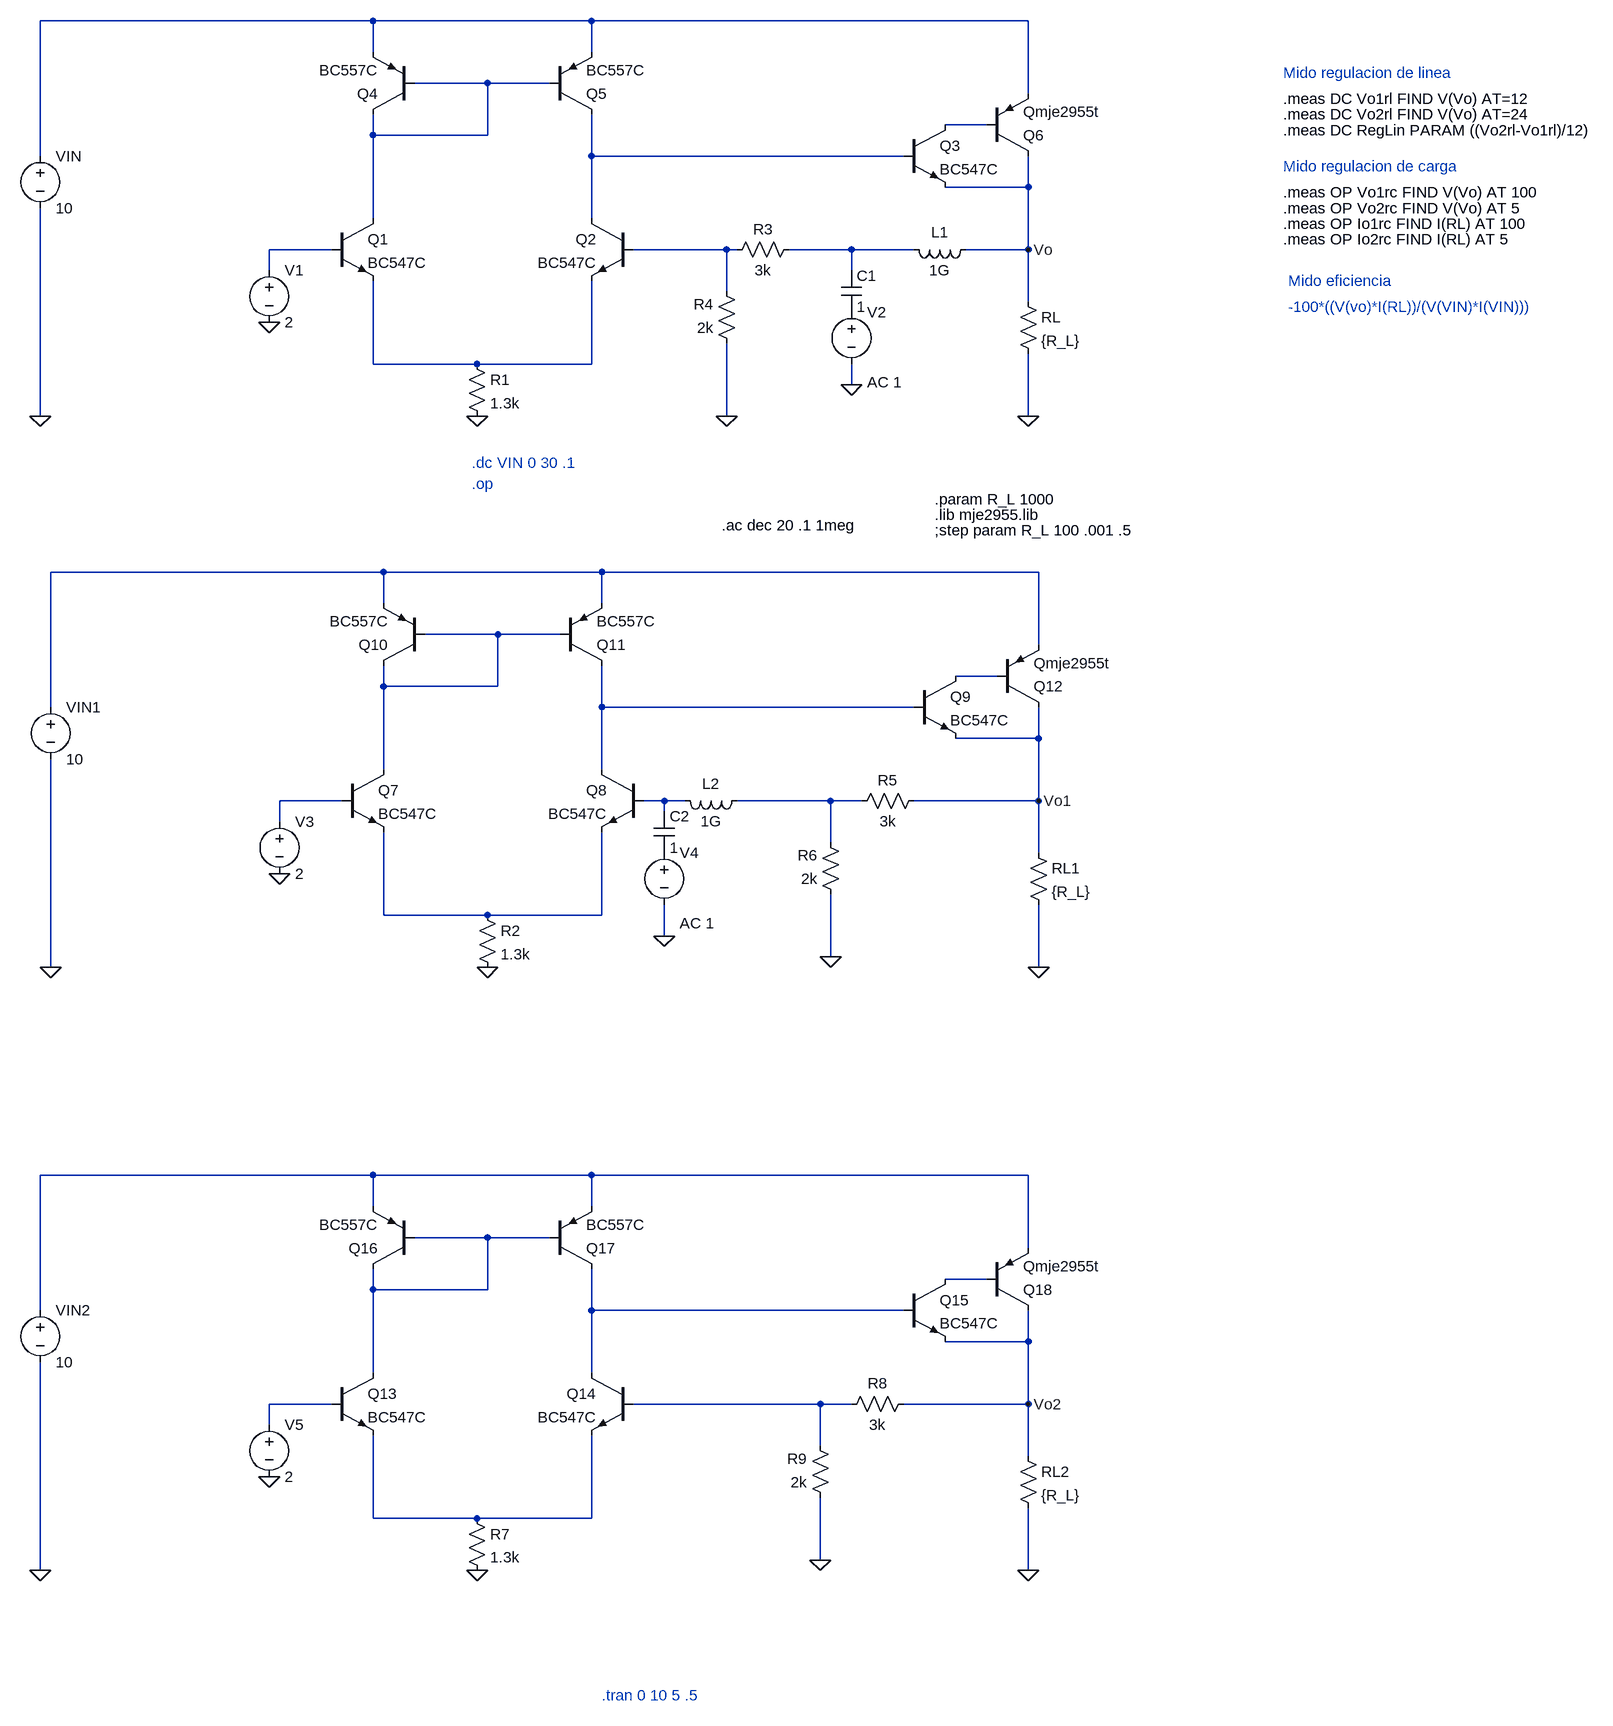
[diagram p0: schematic primer_check_2.asc]
primer_check_2.asc, the LTspice schematic file:
Version 4.1
SHEET 1 2012 2384
WIRE 96 -208 -416 -208
WIRE 432 -208 96 -208
WIRE 1104 -208 432 -208
WIRE 96 -160 96 -208
WIRE 432 -160 432 -208
WIRE 272 -112 160 -112
WIRE 368 -112 272 -112
WIRE 1104 -96 1104 -208
WIRE 1040 -48 976 -48
WIRE 96 -32 96 -64
WIRE 272 -32 272 -112
WIRE 272 -32 96 -32
WIRE -416 0 -416 -208
WIRE 432 0 432 -64
WIRE 912 0 432 0
WIRE 1104 48 1104 0
WIRE 1104 48 976 48
WIRE 96 96 96 -32
WIRE 432 96 432 0
WIRE 32 144 -64 144
WIRE 640 144 496 144
WIRE 656 144 640 144
WIRE 832 144 736 144
WIRE 928 144 832 144
WIRE 1104 144 1104 48
WIRE 1104 144 1008 144
WIRE -64 176 -64 144
WIRE 832 176 832 144
WIRE 640 208 640 144
WIRE 1104 224 1104 144
WIRE 96 320 96 192
WIRE 256 320 96 320
WIRE 432 320 432 192
WIRE 432 320 256 320
WIRE 832 352 832 320
WIRE -416 400 -416 80
WIRE 640 400 640 288
WIRE 1104 400 1104 304
WIRE 112 640 -400 640
WIRE 448 640 112 640
WIRE 1120 640 448 640
WIRE 112 688 112 640
WIRE 448 688 448 640
WIRE 288 736 176 736
WIRE 384 736 288 736
WIRE 1120 752 1120 640
WIRE 1056 800 992 800
WIRE 112 816 112 784
WIRE 288 816 288 736
WIRE 288 816 112 816
WIRE -400 848 -400 640
WIRE 448 848 448 784
WIRE 928 848 448 848
WIRE 1120 896 1120 848
WIRE 1120 896 992 896
WIRE 112 944 112 816
WIRE 448 944 448 848
WIRE 48 992 -48 992
WIRE 544 992 512 992
WIRE 576 992 544 992
WIRE 800 992 656 992
WIRE 848 992 800 992
WIRE 1120 992 1120 896
WIRE 1120 992 928 992
WIRE 544 1008 544 992
WIRE -48 1024 -48 992
WIRE 800 1056 800 992
WIRE 1120 1072 1120 992
WIRE 112 1168 112 1040
WIRE 272 1168 112 1168
WIRE 448 1168 448 1040
WIRE 448 1168 272 1168
WIRE 544 1200 544 1152
WIRE 800 1232 800 1136
WIRE -400 1248 -400 928
WIRE 1120 1248 1120 1152
WIRE 96 1568 -416 1568
WIRE 432 1568 96 1568
WIRE 1104 1568 432 1568
WIRE 96 1616 96 1568
WIRE 432 1616 432 1568
WIRE 272 1664 160 1664
WIRE 368 1664 272 1664
WIRE 1104 1680 1104 1568
WIRE 1040 1728 976 1728
WIRE 96 1744 96 1712
WIRE 272 1744 272 1664
WIRE 272 1744 96 1744
WIRE -416 1776 -416 1568
WIRE 432 1776 432 1712
WIRE 912 1776 432 1776
WIRE 1104 1824 1104 1776
WIRE 1104 1824 976 1824
WIRE 96 1872 96 1744
WIRE 432 1872 432 1776
WIRE 32 1920 -64 1920
WIRE 784 1920 496 1920
WIRE 832 1920 784 1920
WIRE 1104 1920 1104 1824
WIRE 1104 1920 912 1920
WIRE -64 1952 -64 1920
WIRE 784 1984 784 1920
WIRE 1104 2000 1104 1920
WIRE 96 2096 96 1968
WIRE 256 2096 96 2096
WIRE 432 2096 432 1968
WIRE 432 2096 256 2096
WIRE 784 2160 784 2064
WIRE -416 2176 -416 1856
WIRE 1104 2176 1104 2080
FLAG -64 256 0
FLAG 256 400 0
FLAG 1104 400 0
FLAG -416 400 0
FLAG 640 400 0
FLAG 1104 144 Vo
FLAG 832 352 0
FLAG -48 1104 0
FLAG 272 1248 0
FLAG 1120 1248 0
FLAG -400 1248 0
FLAG 800 1232 0
FLAG 1120 992 Vo1
FLAG 544 1200 0
FLAG -64 2032 0
FLAG 256 2176 0
FLAG 1104 2176 0
FLAG -416 2176 0
FLAG 784 2160 0
FLAG 1104 1920 Vo2
SYMBOL npn 32 96 R0
SYMATTR InstName Q1
SYMATTR Value BC547C
SYMBOL npn 496 96 M0
SYMATTR InstName Q2
SYMATTR Value BC547C
SYMBOL npn 912 -48 R0
SYMATTR InstName Q3
SYMATTR Value BC547C
SYMBOL pnp 160 -64 R180
SYMATTR InstName Q4
SYMATTR Value BC557C
SYMBOL pnp 368 -64 M180
SYMATTR InstName Q5
SYMATTR Value BC557C
SYMBOL res 240 304 R0
SYMATTR InstName R1
SYMATTR Value 1.3k
SYMBOL voltage -64 160 R0
WINDOW 123 0 0 Left 0
WINDOW 39 0 0 Left 0
SYMATTR InstName V1
SYMATTR Value 2
SYMBOL voltage -416 -16 R0
WINDOW 123 0 0 Left 0
WINDOW 39 0 0 Left 0
SYMATTR InstName VIN
SYMATTR Value 10
SYMBOL pnp 1040 0 M180
SYMATTR InstName Q6
SYMATTR Value Qmje2955t
SYMBOL res 1088 208 R0
SYMATTR InstName RL
SYMATTR Value {R_L}
SYMBOL res 752 128 R90
WINDOW 0 0 56 VBottom 2
WINDOW 3 32 56 VTop 2
SYMATTR InstName R3
SYMATTR Value 3k
SYMBOL res 656 304 R180
WINDOW 0 36 76 Left 2
WINDOW 3 36 40 Left 2
SYMATTR InstName R4
SYMATTR Value 2k
SYMBOL ind 1024 128 R90
WINDOW 0 5 56 VBottom 2
WINDOW 3 32 56 VTop 2
SYMATTR InstName L1
SYMATTR Value 1G
SYMBOL voltage 832 224 R0
WINDOW 123 24 124 Left 2
WINDOW 39 0 0 Left 0
SYMATTR Value2 AC 1
SYMATTR InstName V2
SYMATTR Value ""
SYMBOL cap 816 176 R0
SYMATTR InstName C1
SYMATTR Value 1
SYMBOL npn 48 944 R0
SYMATTR InstName Q7
SYMATTR Value BC547C
SYMBOL npn 512 944 M0
SYMATTR InstName Q8
SYMATTR Value BC547C
SYMBOL npn 928 800 R0
SYMATTR InstName Q9
SYMATTR Value BC547C
SYMBOL pnp 176 784 R180
SYMATTR InstName Q10
SYMATTR Value BC557C
SYMBOL pnp 384 784 M180
SYMATTR InstName Q11
SYMATTR Value BC557C
SYMBOL res 256 1152 R0
SYMATTR InstName R2
SYMATTR Value 1.3k
SYMBOL voltage -48 1008 R0
WINDOW 123 0 0 Left 0
WINDOW 39 0 0 Left 0
SYMATTR InstName V3
SYMATTR Value 2
SYMBOL voltage -400 832 R0
WINDOW 123 0 0 Left 0
WINDOW 39 0 0 Left 0
SYMATTR InstName VIN1
SYMATTR Value 10
SYMBOL pnp 1056 848 M180
SYMATTR InstName Q12
SYMATTR Value Qmje2955t
SYMBOL res 1104 1056 R0
SYMATTR InstName RL1
SYMATTR Value {R_L}
SYMBOL res 944 976 R90
WINDOW 0 0 56 VBottom 2
WINDOW 3 32 56 VTop 2
SYMATTR InstName R5
SYMATTR Value 3k
SYMBOL res 816 1152 R180
WINDOW 0 36 76 Left 2
WINDOW 3 36 40 Left 2
SYMATTR InstName R6
SYMATTR Value 2k
SYMBOL ind 672 976 R90
WINDOW 0 5 56 VBottom 2
WINDOW 3 32 56 VTop 2
SYMATTR InstName L2
SYMATTR Value 1G
SYMBOL voltage 544 1056 R0
WINDOW 123 24 124 Left 2
WINDOW 39 0 0 Left 0
SYMATTR Value2 AC 1
SYMATTR InstName V4
SYMATTR Value ""
SYMBOL cap 528 1008 R0
SYMATTR InstName C2
SYMATTR Value 1
SYMBOL npn 32 1872 R0
SYMATTR InstName Q13
SYMATTR Value BC547C
SYMBOL npn 496 1872 M0
SYMATTR InstName Q14
SYMATTR Value BC547C
SYMBOL npn 912 1728 R0
SYMATTR InstName Q15
SYMATTR Value BC547C
SYMBOL pnp 160 1712 R180
SYMATTR InstName Q16
SYMATTR Value BC557C
SYMBOL pnp 368 1712 M180
SYMATTR InstName Q17
SYMATTR Value BC557C
SYMBOL res 240 2080 R0
SYMATTR InstName R7
SYMATTR Value 1.3k
SYMBOL voltage -64 1936 R0
WINDOW 123 0 0 Left 0
WINDOW 39 0 0 Left 0
SYMATTR InstName V5
SYMATTR Value 2
SYMBOL voltage -416 1760 R0
WINDOW 123 0 0 Left 0
WINDOW 39 0 0 Left 0
SYMATTR InstName VIN2
SYMATTR Value 10
SYMBOL pnp 1040 1776 M180
SYMATTR InstName Q18
SYMATTR Value Qmje2955t
SYMBOL res 1088 1984 R0
SYMATTR InstName RL2
SYMATTR Value {R_L}
SYMBOL res 928 1904 R90
WINDOW 0 0 56 VBottom 2
WINDOW 3 32 56 VTop 2
SYMATTR InstName R8
SYMATTR Value 3k
SYMBOL res 800 2080 R180
WINDOW 0 36 76 Left 2
WINDOW 3 36 40 Left 2
SYMATTR InstName R9
SYMATTR Value 2k
TEXT 960 528 Left 2 !.param R_L 1000
TEXT 960 552 Left 2 !.lib mje2955.lib
TEXT 248 472 Left 2 ;.dc VIN 0 30 .1
TEXT 960 576 Left 2 !;step param R_L 100 .001 .5
TEXT 248 504 Left 2 ;.op
TEXT 1496 -128 Left 2 ;Mido regulacion de linea
TEXT 1496 -88 Left 2 !.meas DC Vo1rl FIND V(Vo) AT=12
TEXT 1496 -64 Left 2 !.meas DC Vo2rl FIND V(Vo) AT=24
TEXT 1496 -40 Left 2 !.meas DC RegLin PARAM ((Vo2rl-Vo1rl)/12)
TEXT 1496 16 Left 2 ;Mido regulacion de carga
TEXT 1496 56 Left 2 !.meas OP Vo1rc FIND V(Vo) AT 100
TEXT 1496 80 Left 2 !.meas OP Vo2rc FIND V(Vo) AT 5
TEXT 1496 104 Left 2 !.meas OP Io1rc FIND I(RL) AT 100
TEXT 1496 128 Left 2 !.meas OP Io2rc FIND I(RL) AT 5
TEXT 1504 192 Left 2 ;Mido eficiencia
TEXT 1504 232 Left 2 ;-100*((V(vo)*I(RL))/(V(VIN)*I(VIN)))
TEXT 632 568 Left 2 !.ac dec 20 .1 1meg
TEXT 448 2368 Left 2 ;.tran 0 10 5 .5

The netlist it stands for:
* primer_check_2.asc
Q1 N002 N005 N008 0 BC547C
Q2 N004 N006 N008 0 BC547C
Q3 N003 N004 Vo 0 BC547C
Q4 N002 N002 N001 0 BC557C
Q5 N004 N002 N001 0 BC557C
R1 N008 0 1.3k
V1 N005 0 2
VIN N001 0 10
Q6 Vo N003 N001 0 Qmje2955t
RL Vo 0 {R_L}
R3 N007 N006 3k
R4 0 N006 2k
L1 Vo N007 1G
V2 P001 0 AC 1
C1 N007 P001 1
Q7 N010 N013 N016 0 BC547C
Q8 N012 N014 N016 0 BC547C
Q9 N011 N012 Vo1 0 BC547C
Q10 N010 N010 N009 0 BC557C
Q11 N012 N010 N009 0 BC557C
R2 N016 0 1.3k
V3 N013 0 2
VIN1 N009 0 10
Q12 Vo1 N011 N009 0 Qmje2955t
RL1 Vo1 0 {R_L}
R5 Vo1 N015 3k
R6 0 N015 2k
L2 N015 N014 1G
V4 P002 0 AC 1
C2 N014 P002 1
Q13 N018 N021 N023 0 BC547C
Q14 N020 N022 N023 0 BC547C
Q15 N019 N020 Vo2 0 BC547C
Q16 N018 N018 N017 0 BC557C
Q17 N020 N018 N017 0 BC557C
R7 N023 0 1.3k
V5 N021 0 2
VIN2 N017 0 10
Q18 Vo2 N019 N017 0 Qmje2955t
RL2 Vo2 0 {R_L}
R8 Vo2 N022 3k
R9 0 N022 2k
.model NPN NPN
.model PNP PNP
.lib standard.bjt
.param R_L 1000
.lib mje2955.lib
* .dc VIN 0 30 .1
;step param R_L 100 .001 .5
* .op
* Mido regulacion de linea
.meas DC Vo1rl FIND V(Vo) AT=12
.meas DC Vo2rl FIND V(Vo) AT=24
.meas DC RegLin PARAM ((Vo2rl-Vo1rl)/12)
* Mido regulacion de carga
.meas OP Vo1rc FIND V(Vo) AT 100
.meas OP Vo2rc FIND V(Vo) AT 5
.meas OP Io1rc FIND I(RL) AT 100
.meas OP Io2rc FIND I(RL) AT 5
* Mido eficiencia
* -100*((V(vo)*I(RL))/(V(VIN)*I(VIN)))
.ac dec 20 .1 1meg
* .tran 0 10 5 .5
.backanno
.end